# Altium schematic sheet AB_Amplifier.SchDoc
size Letter
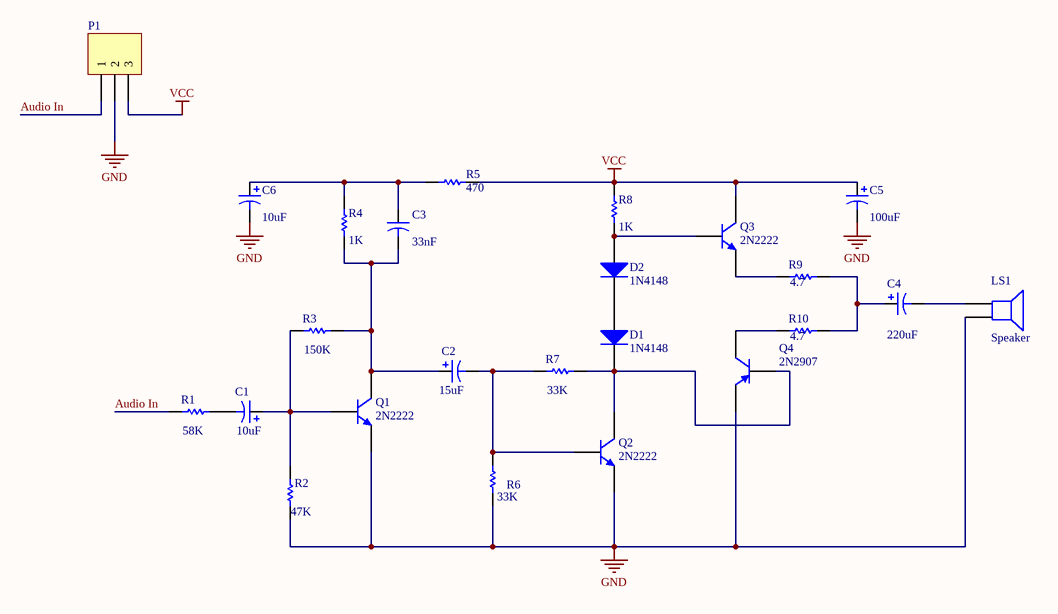
[diagram p0: AB_Amplifier.SchDoc]

## Parts
C1  value 10uF  [CAPR5-4X5]  (hidden comment: Cap Pol1)
C2  value 15uF  [CAPR5-4X5]  (hidden comment: Cap Pol1)
C3  value 33nF  [CAPR5-4X5]  (hidden comment: Cap2)
C4  value 220uF  [CAPR5-4X5]  (hidden comment: Cap Pol1)
C5  value 100uF  [CAPR5-4X5]  (hidden comment: Cap Pol1)
C6  value 10uF  [CAPR5-4X5]  (hidden comment: Cap Pol1)
D1  1N4148  [DO-35]
D2  1N4148  [DO-35]
LS1  Speaker  [PIN2]
P1  Header 3  [HDR1X3]  (value not drawn)
Q1  2N2222  [TO-226-AA]
Q2  2N2222  [TO-226-AA]
Q3  2N2222  [TO-226-AA]
Q4  2N2907  [TO-226-AA]
R1  value 58K  [AXIAL-0.3]  (hidden comment: Res1)
R2  value 47K  [AXIAL-0.3]  (hidden comment: Res1)
R3  value 150K  [AXIAL-0.3]  (hidden comment: Res1)
R4  value 1K  [AXIAL-0.3]  (hidden comment: Res1)
R5  value 470  [AXIAL-0.3]  (hidden comment: Res1)
R6  value 33K  [AXIAL-0.3]  (hidden comment: Res1)
R7  value 33K  [AXIAL-0.3]  (hidden comment: Res1)
R8  value 1K  [AXIAL-0.3]  (hidden comment: Res1)
R9  value 4.7  [AXIAL-0.3]  (hidden comment: Res1)
R10  value 4.7  [AXIAL-0.3]

## Nets
GND: C5.2 C6.2 LS1.2 P1.2 Q1.3(E) Q2.3(E) Q4.3(E) R2.1 R6.2
VCC: C5.1 P1.3 Q3.1(C) R5.2 R8.2
Audio In: P1.1 R1.1
NetC1_1: C1.1 Q1.2(B) R2.2 R3.2
NetC1_2: C1.2 R1.2
NetC2_1: C2.1 C3.2 Q1.1(C) R3.1 R4.2
NetC2_2: C2.2 Q2.2(B) R6.1 R7.2
NetC3_1: C3.1 C6.1 R4.1 R5.1
NetC4_1: C4.1 R9.2 R10.2
NetC4_2: C4.2 LS1.1
NetD1_1: D1.1(A) D2.2(K)
NetD1_2: D1.2(K) Q2.1(C) Q4.2(B) R7.1
NetD2_1: D2.1(A) Q3.2(B) R8.1
NetQ3_3: Q3.3(E) R9.1
NetQ4_1: Q4.1(C) R10.1

## Library data of the parts
C1 C2 C4-C6 = Cap Pol1: Polarized Capacitor (Radial); Published: 8-Jun-2000; LatestRevisionDate: 17-Jul-2002; LatestRevisionNote: Re-released for DXP Platform.; PackageReference: RB7.6-15; Publisher: Altium Limited; PackageDescription: Polarized Capacitor (Radial); 2 Leads
C3 = Cap2: Capacitor; Published: 23-Sep-2002; PackageReference: CAPR5-4X5; Publisher: Altium Limited; PackageDescription: Capacitor; 2 Leads
D1 D2 = Diode 1N4148: High Conductance Fast Diode; Published: 8-Jun-2000; LatestRevisionDate: 17-Jul-2002; LatestRevisionNote: Re-released for DXP Platform.; DatasheetVersion: 1997; PackageReference: DO-35; Publisher: Altium Limited; PackageDescription: Diode, Axial; Body 3.8 x 1.9 mm (LxDia. max), Lead Dia. 0.53 mm (max); Code_JEDEC: DO-204-AH; ComponentLink1Description: Manufacturer Link; ComponentLink1URL: http://www.fairchildsemi.com/; ComponentLink2Description: Datasheet; ComponentLink2URL: http://www.fairchildsemi.com/ds/1N%2F1N4148.pdf
LS1 = Speaker: Loudspeaker; Published: 24-Mar-1999; LatestRevisionDate: 17-Jul-2002; LatestRevisionNote: Re-released for DXP Platform.; PackageReference: PIN2; Publisher: Altium Limited
P1 = Header 3: Header, 3-Pin; LatestRevisionDate: 17-Jul-2002; LatestRevisionNote: Re-released for DXP Platform.; Publisher: Altium Limited
Q1-Q3 = NPN: NPN Bipolar Transistor; Published: 8-Jun-2000; LatestRevisionDate: 17-Jul-2002; LatestRevisionNote: Re-released for DXP Platform.; PackageReference: TO-226-AA; Publisher: Altium Limited; PackageDescription: TO, Flat Index; 3 In-Line, Axial Leads; Body Dia. 4.8mm; Leads 0.55 x 0.51 mm (max); Code_JEDEC: TO-226-AA
Q4 = PNP: PNP Bipolar Transistor; Published: 8-Jun-2000; LatestRevisionDate: 29-May-2009; LatestRevisionNote: IPC-7351 Footprint Added.; PackageVersion: Aug-1999; PackageReference: SOT-23B; Publisher: Altium Limited; PackageDescription: 3-Pin SOT-23 Package 0.95 mm Pitch, 2.4 mm Lead Span
R1-R10 = Res1: Resistor; Published: 8-Jun-2000; LatestRevisionDate: 17-Jul-2002; LatestRevisionNote: Re-released for DXP Platform.; PackageReference: AXIAL-0.3; Publisher: Altium Limited; PackageDescription: Axial Device, Thru-Hole; 2 Leads; 0.3 in Pin Spacing